# EAGLE design manhole (EAGLE 9.6.2)
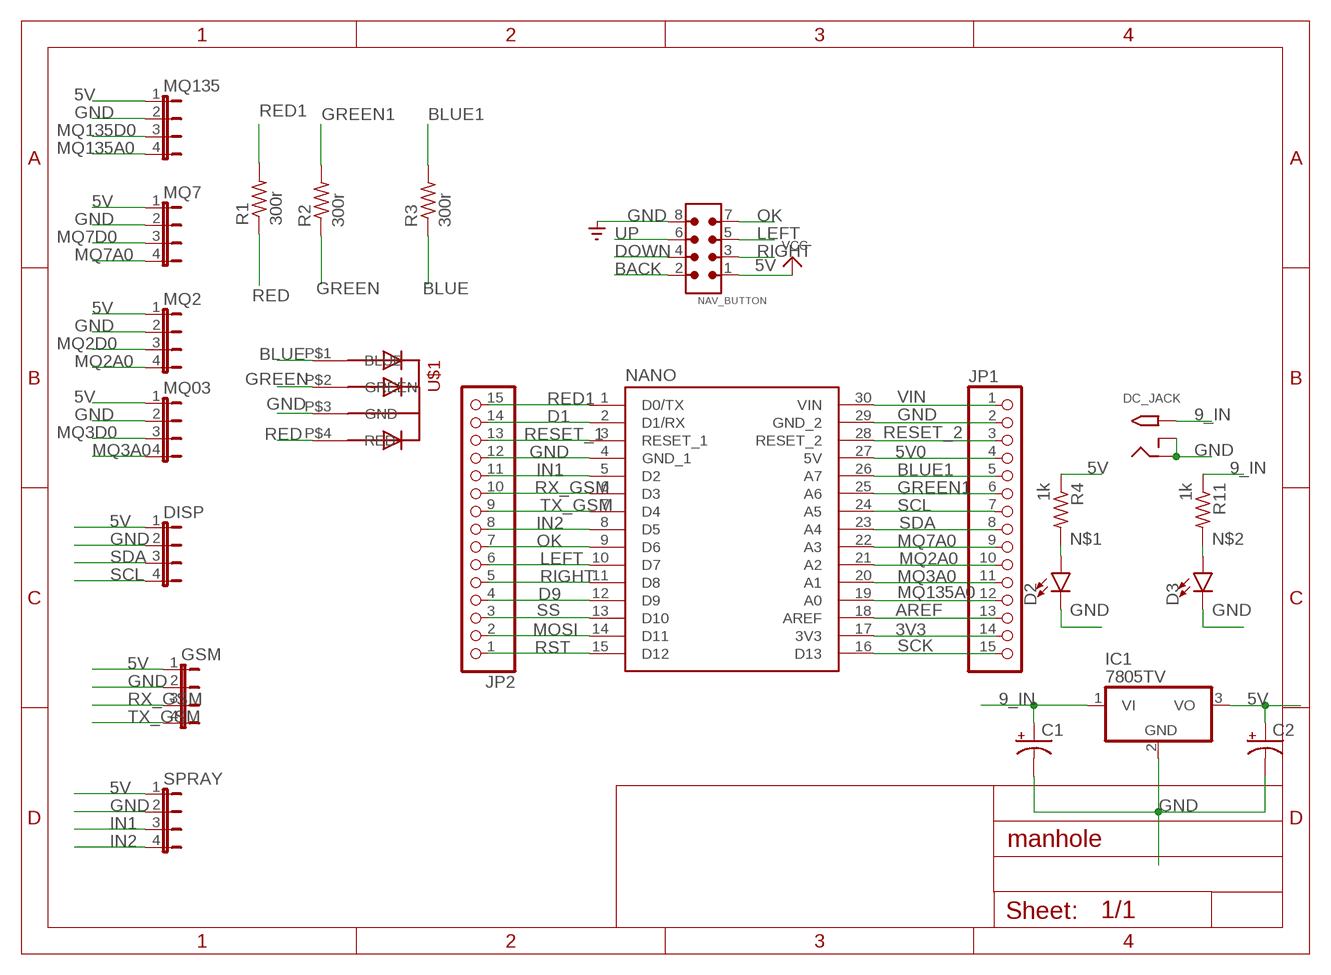
[diagram p0: schematic, sheet 1]

## Parts
C1  CPOL-USE3.5-8  [E3,5-8]
C2  CPOL-USE3.5-8  [E3,5-8]
D2  LED3MM  [LED_3MM]
D3  LED3MM  [LED_3MM]
DC_JACK  2.1MMJACKTHM  [PJ-102A]
DISP  JP4E  [JP4]
GSM  JP4E  [JP4]
IC1  7805TV  [TO220V]
JP1  PINHD-1X15  [1X15]
JP2  PINHD-1X15  [1X15]
MQ2  JP4E  [JP4]
MQ03  JP4E  [JP4]
MQ7  JP4E  [JP4]
MQ135  JP4E  [JP4]
NANO  A000005  [MODULE_A000005]
NAV_BUTTON  6120XX21621_61200821621  [61200821621]
R1  300r  R-US_M0805  [M0805]
R2  300r  R-US_M0805  [M0805]
R3  300r  R-US_M0805  [M0805]
R4  1k  R-US_M0805  [M0805]
R11  1k  R-US_M0805  [M0805]
SPRAY  JP4E  [JP4]
U$1  5MMRGBLED  [LED5MMRGB]

## Nets
3V3: JP1.14 NANO.17(3V3)
5V: C2.+ DISP.1 GSM.1 IC1.3(VO) MQ2.1 MQ03.1 MQ7.1 MQ135.1 NAV_BUTTON.1 R4.1 SPRAY.1 ; supply symbol labelled VCC
5V0: JP1.4 NANO.27(5V)
9_IN: C1.+ DC_JACK.TIP IC1.1(VI) R11.1
AREF: JP1.13 NANO.18(AREF)
BACK: NAV_BUTTON.2
BLUE: R3.1 U$1.P$1(BLUE)
BLUE1: JP1.5 NANO.26(A7) R3.2
D1: JP2.14 NANO.2(D1/RX)
D9: JP2.4 NANO.12(D9)
DOWN: NAV_BUTTON.4
GND: C1.- C2.- D2.K(C) D3.K(C) DC_JACK.RING DC_JACK.RING_SW DISP.2 GSM.2 IC1.2(GND) JP1.2 JP2.12 MQ2.2 MQ03.2 MQ7.2 MQ135.2 NANO.4(GND_1) NANO.29(GND_2) NAV_BUTTON.8 SPRAY.2 U$1.P$3(GND) ; supply symbol labelled SUPPLY0_GND_
GREEN: R2.1 U$1.P$2(GREEN)
GREEN1: JP1.6 NANO.25(A6) R2.2
IN1: JP2.11 NANO.5(D2) SPRAY.3
IN2: JP2.8 NANO.8(D5) SPRAY.4
LEFT: JP2.6 NANO.10(D7) NAV_BUTTON.5
MOSI: JP2.2 NANO.14(D11)
MQ2A0: JP1.10 MQ2.4 NANO.21(A2)
MQ2D0: MQ2.3
MQ3A0: JP1.11 MQ03.4 NANO.20(A1)
MQ3D0: MQ03.3
MQ7A0: JP1.9 MQ7.4 NANO.22(A3)
MQ7D0: MQ7.3
MQ135A0: JP1.12 MQ135.4 NANO.19(A0)
MQ135D0: MQ135.3
N$1: D2.A R4.2
N$2: D3.A R11.2
OK: JP2.7 NANO.9(D6) NAV_BUTTON.7
RED: R1.1 U$1.P$4(RED)
RED1: JP2.15 NANO.1(D0/TX) R1.2
RESET_1: JP2.13 NANO.3(RESET_1)
RESET_2: JP1.3 NANO.28(RESET_2)
RIGHT: JP2.5 NANO.11(D8) NAV_BUTTON.3
RST: JP2.1 NANO.15(D12)
RX_GSM: GSM.3 JP2.10 NANO.6(D3)
SCK: JP1.15 NANO.16(D13)
SCL: DISP.4 JP1.7 NANO.24(A5)
SDA: DISP.3 JP1.8 NANO.23(A4)
SS: JP2.3 NANO.13(D10)
TX_GSM: GSM.4 JP2.9 NANO.7(D4)
UP: NAV_BUTTON.6
VIN: JP1.1 NANO.30(VIN)

## Library data of the parts
C1 C2 = adafruit:CPOL-US: POLARIZED CAPACITOR, American symbol
D2 D3 = SparkFun-LED:LED: LED (Generic) Standard schematic elements and footprints for 5mm, 3mm, 1206, and 0603 sized LEDs. Generic LEDs with no color specified.; PROD_ID: DIO-08794
DC_JACK = adafruit:2.1MMJACK: 2.1mm x 5.5mm THM DC jack with internal switch. Digikey part #PJ-102A, 4UCON part #05537 2.1mm x 5.5mm SMT DC jack with internal switch. Digikey part #PJ-002A-SMT, 4UCON part #03267 By microbuilder.eu & adafruit.com
DISP GSM MQ2 MQ03 MQ7 MQ135 SPRAY = jumper:JP4E: JUMPER
IC1 = linear:78*: Positive VOLTAGE REGULATOR Source: http://cache.national.com/ds/LM/LM78L05.pdf http://www.fairchildsemi.com/ds/LM/LM7805.pdf
JP1 JP2 = adafruit:PINHD-1X15: PIN HEADER
NANO = A000005:A000005: CLOCK SAW OSCILLATOR SEAM7050 T& Check prices <https://pricing.snapeda.com/parts/A000005/Arduino/view-part?ref=eda>; AVAILABILITY: Good; DESCRIPTION: ATmega328 Arduino Nano AVR® ATmega AVR MCU 8-Bit Embedded Evaluation Board; MF: Arduino; MP: A000005; PACKAGE: None; PRICE: None; PURCHASE-URL: https://pricing.snapeda.com/search/part/A000005/?ref=eda
NAV_BUTTON = Wurth_Connectors_WR-BHD:6120XX21621_61200821621: WR-BHD 2.54 mm Male Box Header KIND PROPERTIES: Pitch 2.54 mm Gender:Male MATERIAL PROPERTIES: Insulator Material:PBT Insulator Flammability Rating UL94 V-0 Insulator Color:Black Contact Material :Copper Alloy Contact Plating :Gold Contact Type: Stamped GENERAL INFORMATION: Operating Temperature:-40 °C up to +125 °C Compliance:RoHS Working Voltage: 250 V (AC) Withstanding Voltage:500 V (AC) Contact Resistance: 20 mΩ Insulation Resistance:1000 MΩ CERTIFICATION: UL Approval:E323964 PACKAGING PROPERTIES Packaging :Tray <https://katalog.we-online.com/media/images/v2/o32884v209%20Family_WR-BHD_6120xx21621.jpg> Details see: https://katalog.we-online.com/en/em/BHD_2_54_MALE_BOX_HEADER_6120XX21621 Updated by Yingchun,Shan 2019-10-29 2019 (C) Würth Elektronik; CONTACT-RESISTANCE: 20mOhm; DATASHEET-URL: https://katalog.we-online.com/em/datasheet/61200821621.pdf; GENDER: Male; IR: 3A; L: 17.82mm; MATES: WR-BHD 2.54mm Female IDC Connector with Strain Relief; MOUNT: THT; PACKAGING: Tray; PART-NUMBER: 61200821621; PINS: 8; PITCH: 2.54mm; TOL-R: max.; TYPE: Straight; WORKING-VOLTAGE: 250V(AC)
R1-R4 R11 = adafruit:R-US_: RESISTOR, American symbol
U$1 = led_rgb:5MMRGBLED

## Board
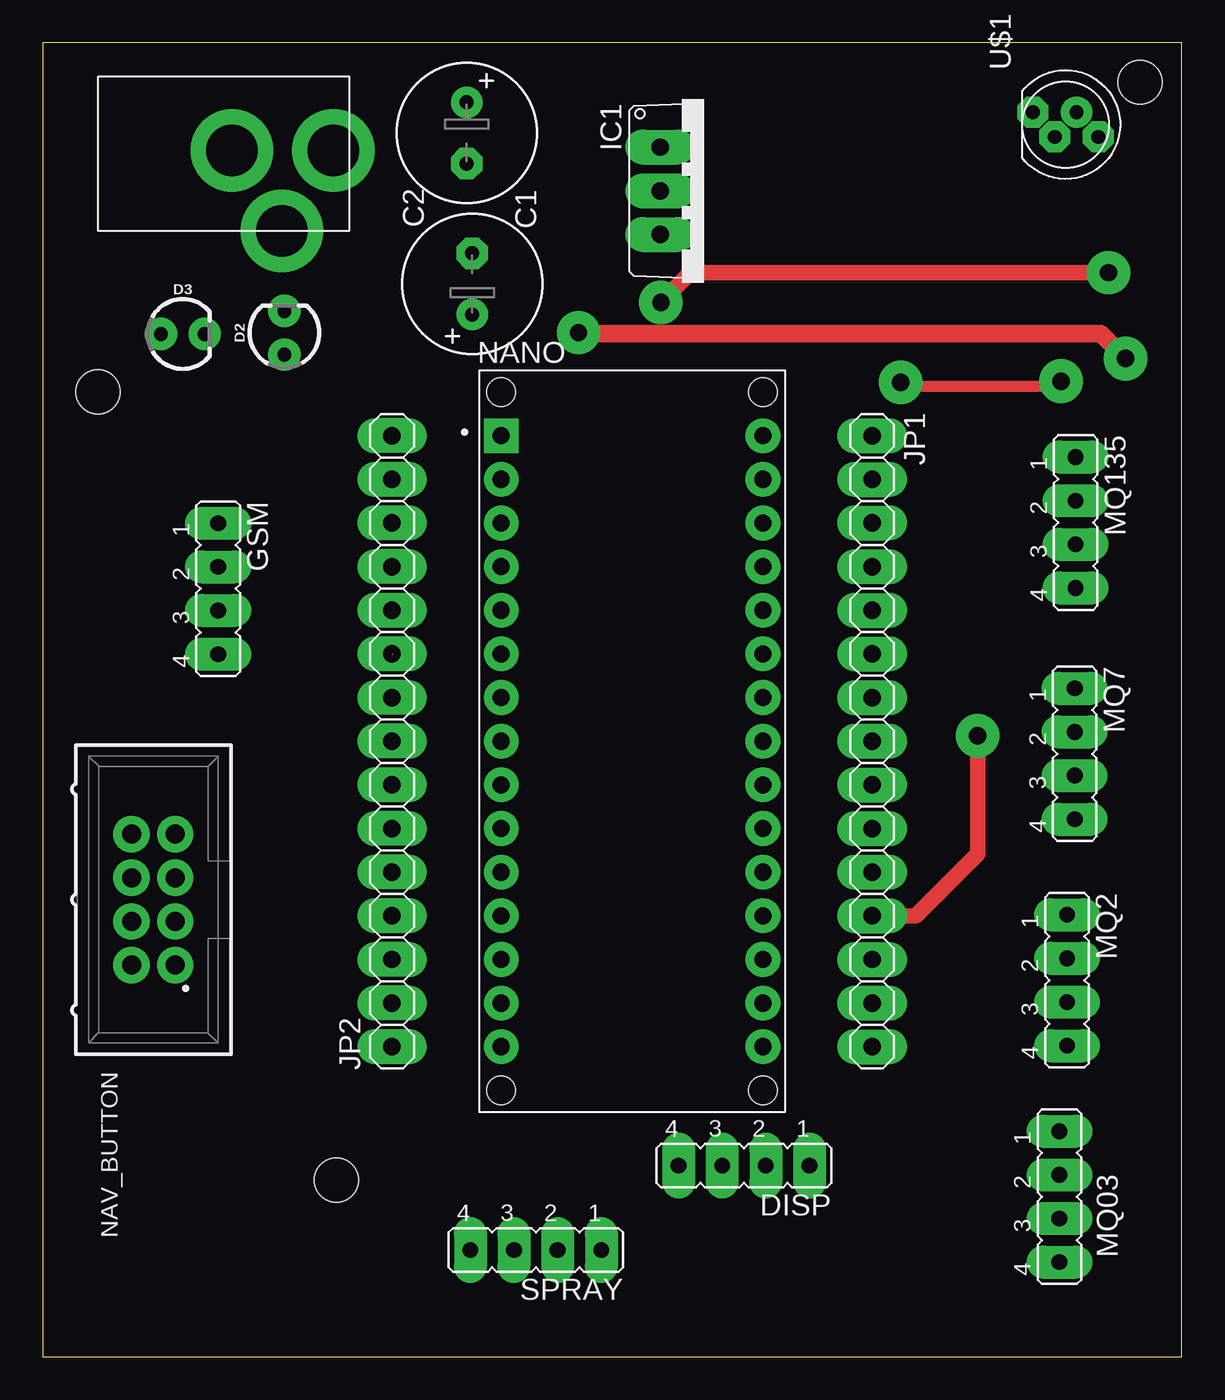
[diagram p1: board, top side]
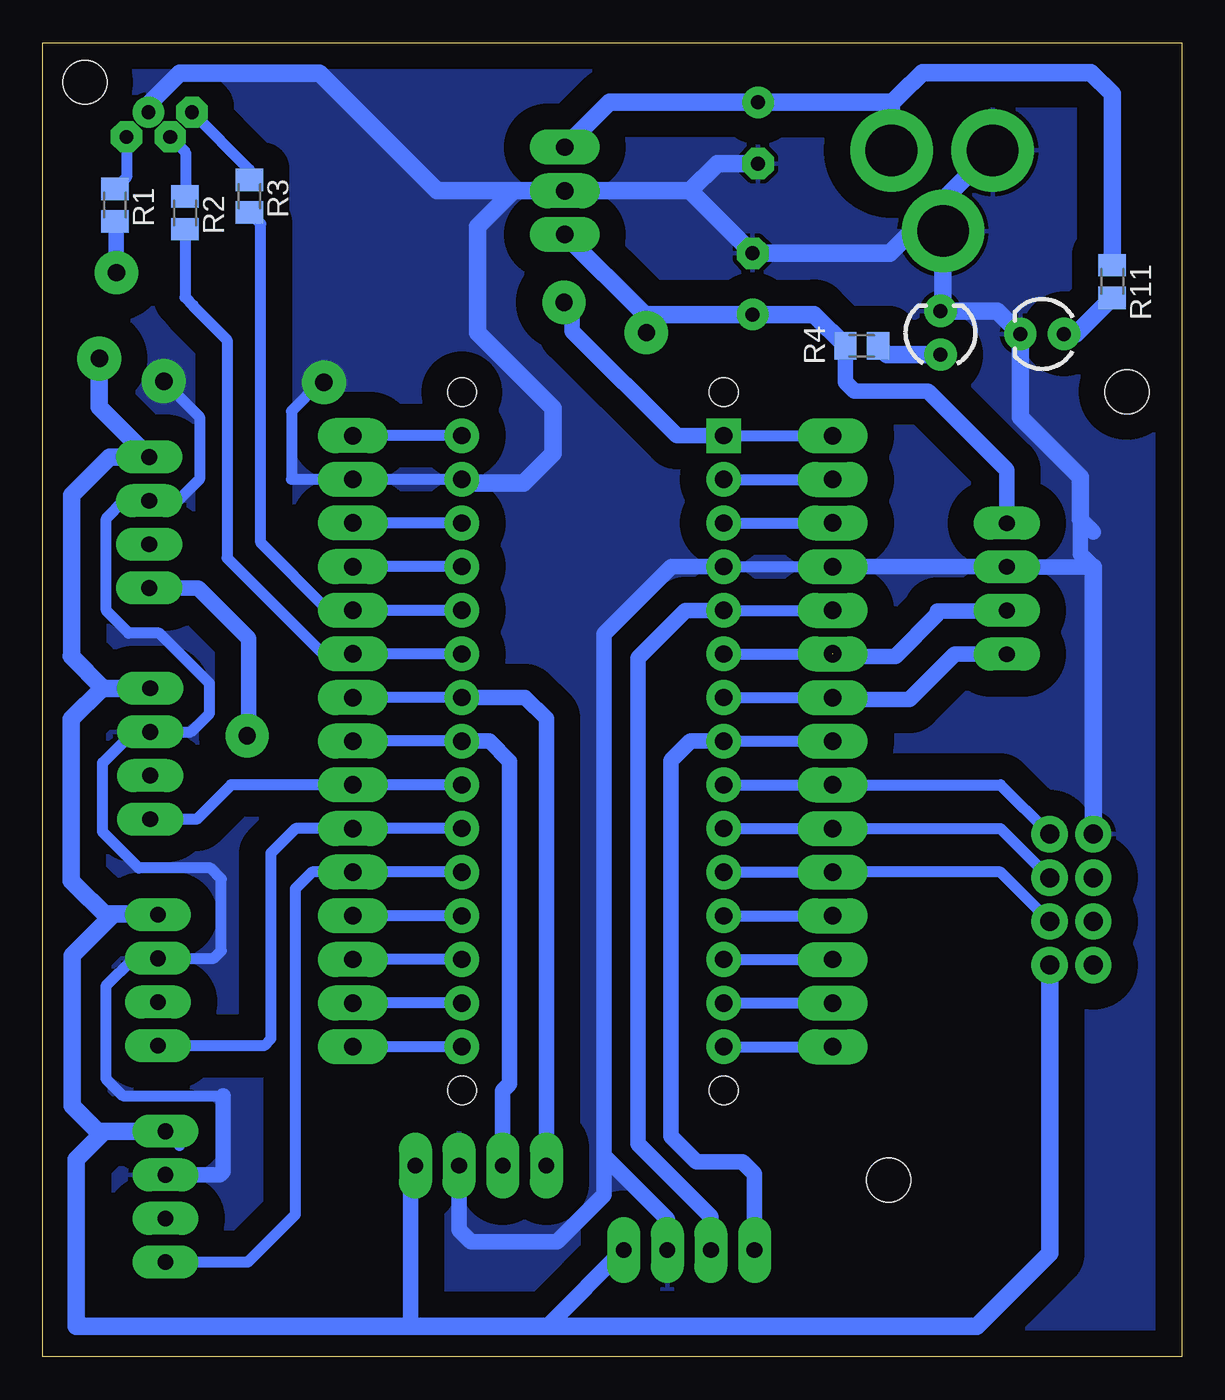
[diagram p2: board, bottom side, seen from below]

Size 66.29 x 76.45 mm. Coordinates in mm from the lower left corner, seen from the top.
Outline: 0,0 66.29,0 66.29,76.45 0,76.45 0,0
Copper layers (1*16): Top 0.035mm / dielectric 1.5mm / Bottom 0.035mm
Design rules "default *": minimum track width 35mil, minimum drill 1mm, track to track 6mil, track to pad 6mil, pad to pad 6mil, via to via 6mil, smd to smd 6mil, copper to edge 40mil, drill to drill 6mil, minimum pad ring 20mil, minimum via ring 30mil, stop-mask expansion 4mil, vias tented up to drill 0mil, thermal gap 10mil
Holes 2.54 mm at 17.08,10.27 63.86,74.17 3.2,56.15

### Footprints (pad centres in the part's own frame; a part is rotated, then mirrored left to right if it is on the bottom)
E3,5-8 = drill 0.813 pad 1.6: + -1.778,0 | drill 0.813 pad 1.6 octagon: - 1.778,0
LED_3MM = drill 0.813 pad 1.88: A -1.27,0; K 1.27,0
PJ-102A = drill 3 pad 4.8: RING 0.1,-3.39; RING_SW -4.6,-6.29; TIP 0.1,-9.29
JP4 = drill 0.914 long: 1 -3.81,0; 2 -1.27,0; 3 1.27,0; 4 3.81,0
TO220V = drill 1.016 long: 1 -2.54,-2.54; 2 0,-2.54; 3 2.54,-2.54
1X15 = drill 1.016 long: 1 -17.78,0; 2 -15.24,0; 3 -12.7,0; 4 -10.16,0; 5 -7.62,0; 6 -5.08,0; 7 -2.54,0; 8 0,0; 9 2.54,0; 10 5.08,0; 11 7.62,0; 12 10.16,0; 13 12.7,0; 14 15.24,0; 15 17.78,0
MODULE_A000005 = drill 1 square: 1 -7.62,17.78 | drill 1: 2 -7.62,15.24; 3 -7.62,12.7; 4 -7.62,10.16; 5 -7.62,7.62; 6 -7.62,5.08; 7 -7.62,2.54; 8 -7.62,0; 9 -7.62,-2.54; 10 -7.62,-5.08; 11 -7.62,-7.62; 12 -7.62,-10.16; 13 -7.62,-12.7; 14 -7.62,-15.24; 15 -7.62,-17.78; 16 7.62,-17.78; 17 7.62,-15.24; 18 7.62,-12.7; 19 7.62,-10.16; 20 7.62,-7.62; 21 7.62,-5.08; 22 7.62,-2.54; 23 7.62,0; 24 7.62,2.54; 25 7.62,5.08; 26 7.62,7.62; 27 7.62,10.16; 28 7.62,12.7; 29 7.62,15.24; 30 7.62,17.78 | hole 1.651: -7.62,-20.32; 7.62,-20.32; -7.62,20.32; 7.62,20.32
61200821621 = drill 1.1: 1 -3.81,-1.27; 2 -3.81,1.27; 3 -1.27,-1.27; 4 -1.27,1.27; 5 1.27,-1.27; 6 1.27,1.27; 7 3.81,-1.27; 8 3.81,1.27
M0805 = smd 1.3 x 1.6: 1 -0.95,0; 2 0.95,0
LED5MMRGB = drill 0.8 pad 0.813 octagon: P$1 -1.905,0.714; P$2 -0.635,-0.714; P$4 1.905,-0.714 | drill 0.8 pad 0.813: P$3 0.635,0.714

### Placement (x,y rotation side)
C1  24.67,71.21 270 top
C2  24.98,62.43 90 top
D2  14.05,59.59 90 top
D3  8.14,59.51 0 top
DC_JACK  7.62,70.1 90 top
DISP  40.81,11.12 180 top
GSM  10.2,44.69 270 top
IC1  38.46,67.85 270 top
JP1  48.26,35.81 270 top
JP2  20.32,35.81 90 top
MQ2  59.6,21.9 270 top
MQ03  59.16,9.3 270 top
MQ7  60.05,35.08 270 top
MQ135  60.11,48.54 270 top
NANO  34.29,35.81 0 top
NAV_BUTTON  6.43,26.6 90 top
R1  62.1,67.02 270 bottom
R2  58.02,66.57 270 bottom
R3  54.28,67.54 270 bottom
R4  18.64,58.82 0 bottom
R11  4.06,62.57 270 bottom
SPRAY  28.69,6.21 180 top
U$1  59.52,71.7 0 top

### Tracks (layer width: path | path; a pad name or v marks a point on that pad's centre or on a via)
3V3
  Bottom 0.635: NANO.17 JP1.14
5V  (via drill 1, 1.02)
  Top 1.016: v31.17,59.6 31.24,59.53 61.57,59.53 v63.02,58.08
  Bottom 0.635: 59.5,13.11 MQ03.1 58.34,12.29 | MQ2.1 60.29,25.71 60.41,25.6 60.57,25.77 | 62.86,38.89 MQ7.1
  Bottom 0.889: 10.2,49.43 GSM.1 10.2,51.6 14.78,56.18 19.06,56.18 19.59,56.72 R4.1 | SPRAY.1 36.81,1.89 36.81,1.75 | DISP.1 44.9,10.84 44.9,1.75
  Bottom 1.016: 62.45,25.49 62.33,25.61 62.49,25.77 60.57,25.77 | 62.45,25.49 63.99,23.95 64.58,23.36 64.58,14.6 63.09,13.11 MQ03.1 62.73,13.11 64.35,11.49 64.35,1.75 44.9,1.75 36.81,1.75 11.95,1.75 7.7,6 NAV_BUTTON.1 | 62.45,25.49 64.65,27.7 64.65,37.1 62.86,38.89 | MQ7.1 62.77,38.89 64.66,40.78 64.63,40.78 64.63,50.14 62.42,52.35 MQ135.1 63.02,55.26 v63.02,58.08 | IC1.3 31.27,60.65 30.74,60.65 | 30.74,60.65 C2.+ 21.42,60.65 R4.1 | 30.74,60.65 31.17,60.22 v31.17,59.6
5V0
  Bottom 0.635: NANO.27 JP1.4
9_IN
  Bottom 1.016: R11.1 4.06,73.49 5.3,74.73 15.12,74.73 16.39,73.47 16.86,72.99 | DC_JACK.TIP 16.91,72.94 16.86,72.99 | IC1.1 33.32,72.99 C1.+ 16.86,72.99
AREF
  Bottom 0.635: NANO.18 JP1.13
BLUE
  Bottom 0.635: U$1.P$1 54.28,69.08 R3.1
BLUE1
  Bottom 0.635: NANO.26 JP1.5 49.69,43.43 53.62,47.36 53.62,65.93 R3.2
D1
  Bottom 0.635: NANO.2 JP2.14
D9
  Bottom 0.635: NANO.12 JP2.4
GND  (via drill 1.02)
  Top 0.635: v59.26,56.77 58.94,56.45 50.19,56.45 v49.93,56.7
  Bottom 0.635: NANO.29 JP1.2 51.83,51.05 51.83,55.02 50.15,56.7 v49.93,56.7 | v59.26,56.77 57.19,54.69 57.19,51.06 58.43,49.81 MQ135.2 61.58,49.81 62.61,48.79 62.61,43.41 61.3,42.1 59.52,42.1 56.6,39.18 56.6,37.43 57.68,36.35 MQ7.2 61.02,36.35 62.82,34.55 62.82,30.54 60.71,28.43 56.54,28.43 55.91,27.8 55.91,23.62 56.35,23.17 MQ2.2 61.02,23.17 62.63,21.56 62.63,16.17 61.65,15.18 55.82,15.18 | NANO.4 JP2.12
  Bottom 0.889: 5.16,48 5.9,48.74 5.9,46.7 5.16,45.96 GSM.2 JP2.12 | SPRAY.2 29.96,8 33.64,11.68 | MQ03.2 56.02,10.57 55.82,10.78 55.82,15.18 | 33.64,11.68 33.64,42.05 29.71,45.97 NANO.4 | 33.64,11.68 33.64,9.41 36.38,6.67 41.37,6.67 42.08,7.37 DISP.2
  Bottom 1.016: 28.62,67.85 C2.- 17.01,64.21 13.91,67.3 | 28.62,67.85 IC1.2 38.91,67.85 | 28.62,67.85 27.04,69.44 C1.- | DC_JACK.RING 13.91,67.3 | 13.91,67.3 DC_JACK.RING_SW 13.91,61 D2.K 10.75,60.86 D3.K 9.41,54.68 5.9,51.18 5.9,48.74 | 38.91,67.85 40.99,65.76 40.99,59.59 36.61,55.21 36.61,52.55 38.34,50.83 41.68,50.83 NANO.29 | U$1.P$3 60.16,72.86 58.33,74.69 50.2,74.69 43.36,67.85 38.91,67.85 | NAV_BUTTON.8 5.16,45.96
  pour Bottom (isolate 1.524): 66.3,0 66.3,76.38 66.32,76.4 0.06,76.41 0.06,0.06 0,0
GREEN
  Bottom 0.635: R2.1 57.99,67.55 57.99,70.09 U$1.P$2
GREEN1
  Bottom 0.635: NANO.25 JP1.6 50,40.89 55.58,46.48 55.58,59.16 57.54,61.12 57.54,61.17 58.02,61.65 R2.2
IN1
  Bottom 0.635: NANO.5 JP2.11
  Bottom 0.889: SPRAY.3 27.42,8.12 31.67,12.38 31.67,40.67 28.9,43.43 NANO.5
IN2
  Bottom 0.635: NANO.8 JP2.8
  Bottom 0.889: NANO.8 28.61,35.81 29.73,34.69 29.73,12.8 28.25,11.32 25.57,11.32 24.88,10.63 SPRAY.4
LEFT
  Bottom 0.635: NANO.10 JP2.6 10.57,30.73 NAV_BUTTON.5
MOSI
  Bottom 0.635: NANO.14 JP2.2
MQ2A0
  Bottom 0.635: NANO.21 JP1.10 51.59,30.73 53.03,29.29 53.03,18.5 53.43,18.09 MQ2.4
MQ3A0
  Bottom 0.635: NANO.20 JP1.11 50.64,28.19 51.61,27.22 51.61,8.25 54.38,5.49 MQ03.4
MQ7A0
  Bottom 0.635: NANO.22 JP1.9 55.35,33.27 57.35,31.27 MQ7.4
MQ135A0  (via drill 1)
  Top 0.889: v54.41,36.13 54.41,29.26 50.8,25.65 JP1.12
  Bottom 0.635: NANO.19 JP1.12
  Bottom 0.889: MQ135.4 57.27,44.73 54.32,41.78 54.32,39.83 54.32,39.33 54.32,36.22 v54.41,36.13
N$1
  Bottom 1.016: R4.2 17.18,58.32 D2.A
N$2
  Bottom 1.016: D3.A 6.16,59.51 R11.2
OK
  Bottom 0.635: NANO.9 JP2.7 10.57,33.27 NAV_BUTTON.7
RED
  Bottom 0.635: U$1.P$4 61.43,68.64 R1.1
RED1  (via drill 1)
  Top 0.889: v62.02,63.08 37.7,63.08 v35.97,61.35
  Bottom 0.635: R1.2 62.06,66.07 | NANO.1 JP2.15
  Bottom 0.889: 62.06,66.07 62.02,66.03 v62.02,63.08 | v35.97,61.35 35.49,60.88 35.49,59.68 29.4,53.59 NANO.1
RESET_1
  Bottom 0.635: NANO.3 JP2.13
RESET_2
  Bottom 0.635: NANO.28 JP1.3
RIGHT
  Bottom 0.635: NANO.11 JP2.5 10.57,28.19 NAV_BUTTON.3
RST
  Bottom 0.635: JP2.1 NANO.15 27.05,17.65
RX_GSM  (1 unrouted)
  Bottom 0.635: NANO.6 JP2.10
  Bottom 0.889: 20.43,40.88 20.34,40.88 | GSM.3 10.23,43.39 14.22,43.39 14.22,43.21 16.68,40.76 20.18,40.76 JP2.10
SCK
  Bottom 0.635: JP1.15 NANO.16 41.88,18
SCL
  Bottom 0.635: NANO.24 JP1.7
  Bottom 0.889: DISP.4 36.99,37.12 38.23,38.35 NANO.24
SDA
  Bottom 0.635: NANO.23 JP1.8
  Bottom 0.889: NANO.23 40.31,35.81 39.12,34.62 39.12,15.87 39.53,15.46 DISP.3
SS
  Bottom 0.635: NANO.13 JP2.3
TX_GSM
  Bottom 0.635: NANO.7 JP2.9
  Bottom 0.889: GSM.4 13.22,40.88 15.85,38.24 20.21,38.24 JP2.9
VIN
  Bottom 0.635: NANO.30 JP1.1